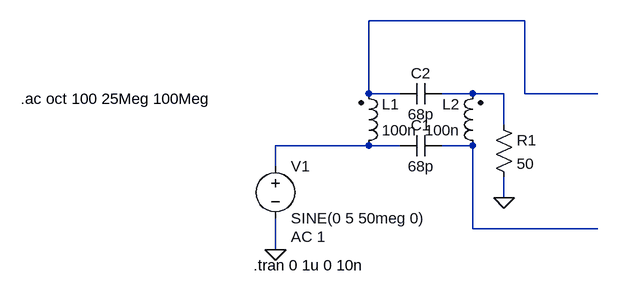
[diagram p0: schematic Draft5.asc]
Draft5.asc, the LTspice schematic file:
Version 4
SHEET 1 1120 680
WIRE 304 -16 64 -16
WIRE 64 96 64 -16
WIRE 112 96 64 96
WIRE 224 96 176 96
WIRE 272 96 224 96
WIRE 304 96 304 -16
WIRE 416 96 304 96
WIRE 272 144 272 96
WIRE 64 176 -80 176
WIRE 112 176 64 176
WIRE 224 176 176 176
WIRE -80 208 -80 176
WIRE 272 256 272 224
WIRE 224 304 224 176
WIRE 416 304 224 304
WIRE -80 336 -80 288
FLAG 272 256 0
FLAG -80 336 0
SYMBOL ind2 48 192 M180
WINDOW 0 36 80 Left 2
WINDOW 3 36 40 Left 2
SYMATTR InstName L1
SYMATTR Value 100n
SYMATTR Type ind
SYMATTR SpiceLine Ipk=1.9 Rser=0.059 Rpar=9.42 Cpar=0 mfg="Coilcraft" pn="PFL1005-101"
SYMBOL ind2 240 192 R180
WINDOW 0 36 80 Left 2
WINDOW 3 36 40 Left 2
SYMATTR InstName L2
SYMATTR Value 100n
SYMATTR Type ind
SYMATTR SpiceLine Ipk=1.9 Rser=0.059 Rpar=9.42 Cpar=0 mfg="Coilcraft" pn="PFL1005-101"
SYMBOL cap 176 160 R90
WINDOW 0 0 32 VBottom 2
WINDOW 3 32 32 VTop 2
SYMATTR InstName C1
SYMATTR Value 68p
SYMATTR SpiceLine V=25 Irms=0 Rser=0 Lser=0 mfg="Murata" pn="GCM0335C1E680JA16" type="C0G"
SYMBOL cap 176 80 R90
WINDOW 0 0 32 VBottom 2
WINDOW 3 32 32 VTop 2
SYMATTR InstName C2
SYMATTR Value 68p
SYMATTR SpiceLine V=25 Irms=0 Rser=0 Lser=0 mfg="Murata" pn="GCM0335C1E680JA16" type="C0G"
SYMBOL res 256 128 R0
SYMATTR InstName R1
SYMATTR Value 50
SYMBOL voltage -80 192 R0
WINDOW 123 24 124 Left 2
WINDOW 39 0 0 Left 0
SYMATTR InstName V1
SYMATTR Value SINE(0 5 50meg 0)
SYMATTR Value2 AC 1
TEXT -114 360 Left 2 !.tran 0 1u 0 10n
TEXT -472 104 Left 2 !.ac oct 100 25Meg 100Meg

The netlist it stands for:
* Draft5.asc
L1 N003 N001 100n Ipk=1.9 Rser=0.059 Rpar=9.42 Cpar=0 mfg="Coilcraft" pn="PFL1005-101"
L2 N004 N002 100n Ipk=1.9 Rser=0.059 Rpar=9.42 Cpar=0 mfg="Coilcraft" pn="PFL1005-101"
C1 N004 N003 68p V=25 Irms=0 Rser=0 Lser=0 mfg="Murata" pn="GCM0335C1E680JA16" type="C0G"
C2 N002 N001 68p V=25 Irms=0 Rser=0 Lser=0 mfg="Murata" pn="GCM0335C1E680JA16" type="C0G"
R1 N002 0 50
V1 N003 0 SINE(0 5 50meg 0) AC 1
.tran 0 1u 0 10n
.ac oct 100 25Meg 100Meg
.backanno
.end